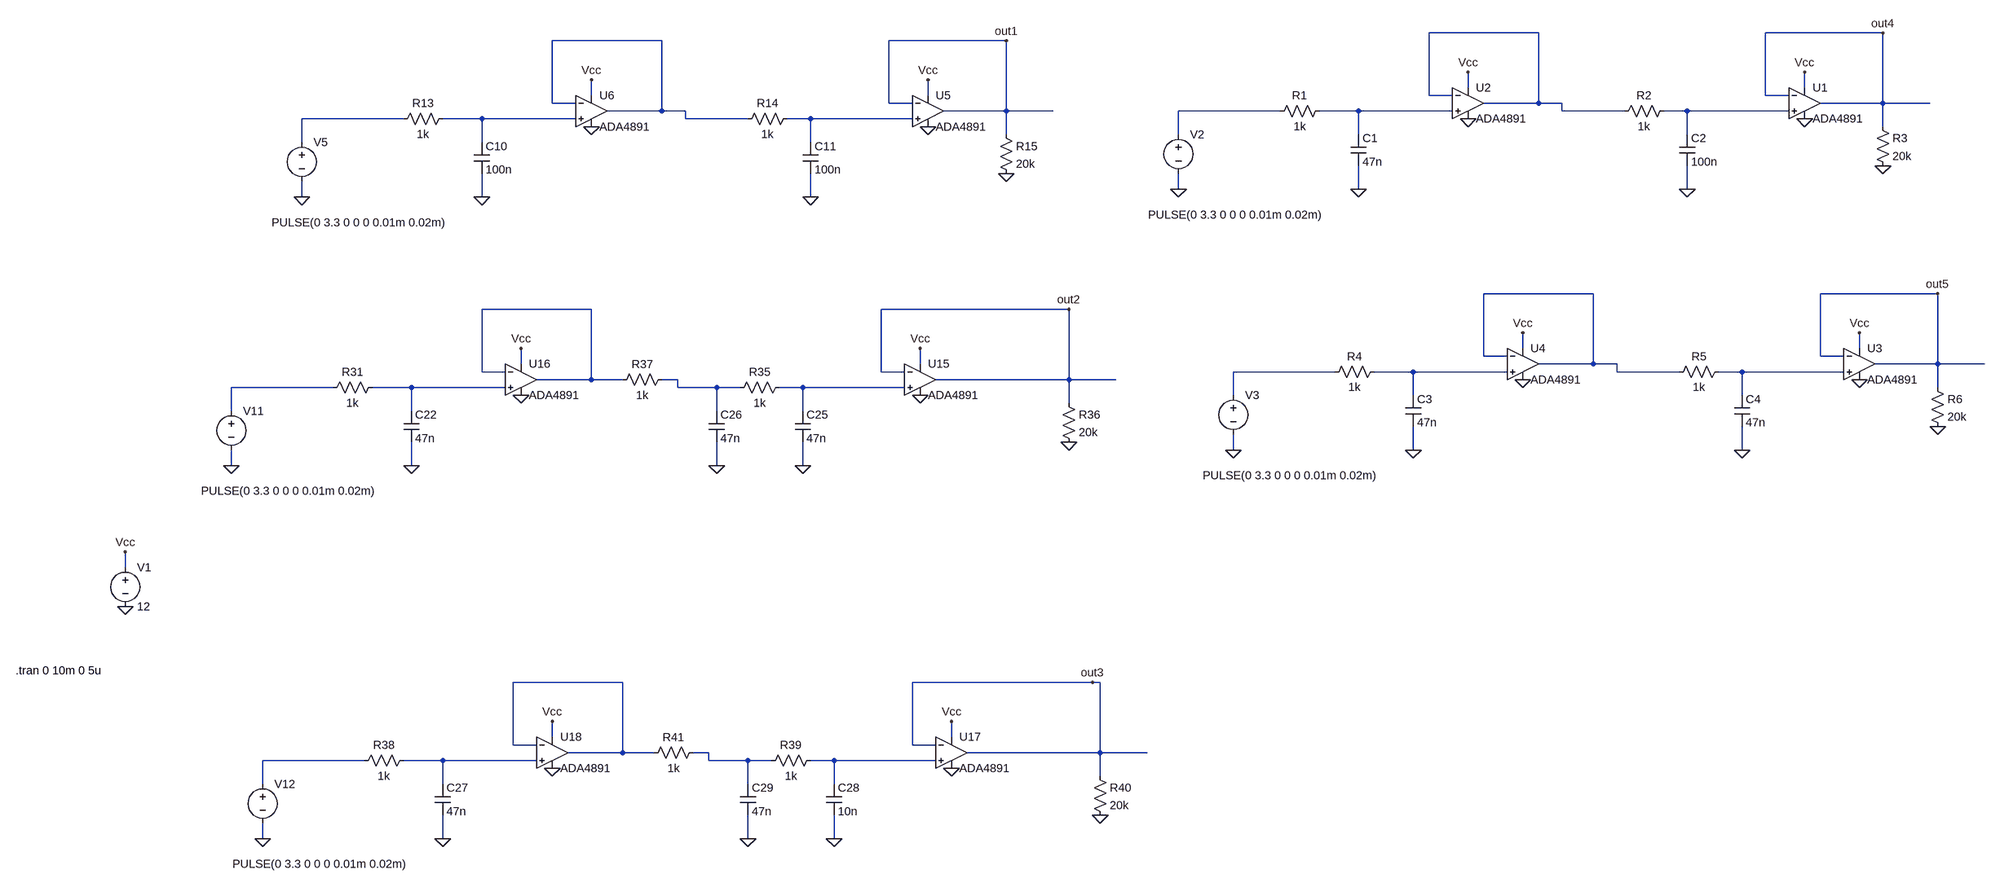
[diagram p0: schematic constant_current.asc]
constant_current.asc, the LTspice schematic file:
Version 4
SHEET 1 3440 3092
WIRE -64 544 -288 544
WIRE 640 544 400 544
WIRE -1856 560 -2080 560
WIRE -1152 560 -1392 560
WIRE -208 656 -208 624
WIRE 480 656 480 624
WIRE -2000 672 -2000 640
WIRE -1312 672 -1312 640
WIRE -288 672 -288 544
WIRE -240 672 -288 672
WIRE 400 672 400 544
WIRE 448 672 400 672
WIRE -2080 688 -2080 560
WIRE -2032 688 -2080 688
WIRE -1392 688 -1392 560
WIRE -1344 688 -1392 688
WIRE -64 688 -64 544
WIRE -64 688 -176 688
WIRE -16 688 -64 688
WIRE 640 688 640 544
WIRE 640 688 512 688
WIRE 736 688 640 688
WIRE -1856 704 -1856 560
WIRE -1856 704 -1968 704
WIRE -1808 704 -1856 704
WIRE -1152 704 -1152 560
WIRE -1152 704 -1280 704
WIRE -1056 704 -1152 704
WIRE -592 704 -800 704
WIRE -432 704 -512 704
WIRE -240 704 -432 704
WIRE -16 704 -16 688
WIRE 112 704 -16 704
WIRE 240 704 192 704
WIRE 448 704 240 704
WIRE -2384 720 -2592 720
WIRE -2224 720 -2304 720
WIRE -2032 720 -2224 720
WIRE -1808 720 -1808 704
WIRE -1680 720 -1808 720
WIRE -1552 720 -1600 720
WIRE -1344 720 -1552 720
WIRE 640 736 640 688
WIRE -1152 752 -1152 704
WIRE -800 752 -800 704
WIRE -432 752 -432 704
WIRE 240 752 240 704
WIRE -2592 768 -2592 720
WIRE -2224 768 -2224 720
WIRE -1552 768 -1552 720
WIRE -800 864 -800 832
WIRE -432 864 -432 816
WIRE 240 864 240 816
WIRE -2592 880 -2592 848
WIRE -2224 880 -2224 832
WIRE -1552 880 -1552 832
WIRE 48 1216 -176 1216
WIRE 752 1216 512 1216
WIRE -2000 1248 -2224 1248
WIRE -1024 1248 -1408 1248
WIRE -96 1328 -96 1296
WIRE 592 1328 592 1296
WIRE -176 1344 -176 1216
WIRE -128 1344 -176 1344
WIRE 512 1344 512 1216
WIRE 560 1344 512 1344
WIRE -2144 1360 -2144 1328
WIRE -1328 1360 -1328 1328
WIRE 48 1360 48 1216
WIRE 48 1360 -64 1360
WIRE 96 1360 48 1360
WIRE 752 1360 752 1216
WIRE 752 1360 624 1360
WIRE 848 1360 752 1360
WIRE -2224 1376 -2224 1248
WIRE -2176 1376 -2224 1376
WIRE -1408 1376 -1408 1248
WIRE -1360 1376 -1408 1376
WIRE -480 1376 -688 1376
WIRE -320 1376 -400 1376
WIRE -128 1376 -320 1376
WIRE 96 1376 96 1360
WIRE 224 1376 96 1376
WIRE 352 1376 304 1376
WIRE 560 1376 352 1376
WIRE -2000 1392 -2000 1248
WIRE -2000 1392 -2112 1392
WIRE -1936 1392 -2000 1392
WIRE -1824 1392 -1856 1392
WIRE -1024 1392 -1024 1248
WIRE -1024 1392 -1296 1392
WIRE -928 1392 -1024 1392
WIRE -2528 1408 -2736 1408
WIRE -2368 1408 -2448 1408
WIRE -2176 1408 -2368 1408
WIRE -1824 1408 -1824 1392
WIRE -1744 1408 -1824 1408
WIRE -1696 1408 -1744 1408
WIRE -1568 1408 -1616 1408
WIRE -1360 1408 -1568 1408
WIRE 752 1408 752 1360
WIRE -688 1424 -688 1376
WIRE -320 1424 -320 1376
WIRE 352 1424 352 1376
WIRE -1024 1440 -1024 1392
WIRE -2736 1456 -2736 1408
WIRE -2368 1456 -2368 1408
WIRE -1744 1456 -1744 1408
WIRE -1568 1456 -1568 1408
WIRE -688 1536 -688 1504
WIRE -320 1536 -320 1488
WIRE 352 1536 352 1488
WIRE -2736 1568 -2736 1536
WIRE -2368 1568 -2368 1520
WIRE -1744 1568 -1744 1520
WIRE -1568 1568 -1568 1520
WIRE -3488 1776 -3488 1744
WIRE -1936 2048 -2160 2048
WIRE -976 2048 -1344 2048
WIRE -960 2048 -976 2048
WIRE -2080 2160 -2080 2128
WIRE -1264 2160 -1264 2128
WIRE -2160 2176 -2160 2048
WIRE -2112 2176 -2160 2176
WIRE -1344 2176 -1344 2048
WIRE -1296 2176 -1344 2176
WIRE -1936 2192 -1936 2048
WIRE -1936 2192 -2048 2192
WIRE -1872 2192 -1936 2192
WIRE -1760 2192 -1792 2192
WIRE -960 2192 -960 2048
WIRE -960 2192 -1232 2192
WIRE -864 2192 -960 2192
WIRE -2464 2208 -2672 2208
WIRE -2304 2208 -2384 2208
WIRE -2112 2208 -2304 2208
WIRE -1760 2208 -1760 2192
WIRE -1680 2208 -1760 2208
WIRE -1632 2208 -1680 2208
WIRE -1504 2208 -1552 2208
WIRE -1296 2208 -1504 2208
WIRE -960 2240 -960 2192
WIRE -2672 2256 -2672 2208
WIRE -2304 2256 -2304 2208
WIRE -1680 2256 -1680 2208
WIRE -1504 2256 -1504 2208
WIRE -2672 2368 -2672 2336
WIRE -2304 2368 -2304 2320
WIRE -1680 2368 -1680 2320
WIRE -1504 2368 -1504 2320
FLAG -3488 1856 0
FLAG -3488 1744 Vcc
FLAG -2592 880 0
FLAG -2224 880 0
FLAG -1552 880 0
FLAG -1312 736 0
FLAG -1312 640 Vcc
FLAG -1152 832 0
FLAG -2000 736 0
FLAG -2000 640 Vcc
FLAG -2736 1568 0
FLAG -2368 1568 0
FLAG -1568 1568 0
FLAG -1328 1424 0
FLAG -1328 1328 Vcc
FLAG -1024 1520 0
FLAG -2144 1424 0
FLAG -2144 1328 Vcc
FLAG -1744 1568 0
FLAG -2672 2368 0
FLAG -2304 2368 0
FLAG -1504 2368 0
FLAG -1264 2224 0
FLAG -1264 2128 Vcc
FLAG -960 2320 0
FLAG -2080 2224 0
FLAG -2080 2128 Vcc
FLAG -1680 2368 0
FLAG -800 864 0
FLAG -432 864 0
FLAG 240 864 0
FLAG 480 720 0
FLAG 480 624 Vcc
FLAG 640 816 0
FLAG -208 720 0
FLAG -208 624 Vcc
FLAG -1152 560 out1
FLAG -1024 1248 out2
FLAG -976 2048 out3
FLAG 640 544 out4
FLAG -688 1536 0
FLAG -320 1536 0
FLAG 352 1536 0
FLAG 592 1392 0
FLAG 592 1296 Vcc
FLAG 752 1488 0
FLAG -96 1392 0
FLAG -96 1296 Vcc
FLAG 752 1216 out5
SYMBOL voltage -3488 1760 R0
WINDOW 123 0 0 Left 0
WINDOW 39 0 0 Left 0
SYMATTR InstName V1
SYMATTR Value 12
SYMBOL voltage -2592 752 R0
WINDOW 123 0 0 Left 0
WINDOW 39 0 0 Left 0
WINDOW 3 -62 180 Left 2
SYMATTR Value PULSE(0 3.3 0 0 0 0.01m 0.02m)
SYMATTR InstName V5
SYMBOL Opamps\\ADA4891 -1312 640 R0
SYMATTR InstName U5
SYMBOL res -2288 704 R90
WINDOW 0 0 56 VBottom 2
WINDOW 3 32 56 VTop 2
SYMATTR InstName R13
SYMATTR Value 1k
SYMBOL res -1584 704 R90
WINDOW 0 0 56 VBottom 2
WINDOW 3 32 56 VTop 2
SYMATTR InstName R14
SYMATTR Value 1k
SYMBOL cap -2240 768 R0
SYMATTR InstName C10
SYMATTR Value 100n
SYMBOL cap -1568 768 R0
SYMATTR InstName C11
SYMATTR Value 100n
SYMBOL res -1168 736 R0
SYMATTR InstName R15
SYMATTR Value 20k
SYMBOL Opamps\\ADA4891 -2000 640 R0
SYMATTR InstName U6
SYMBOL voltage -2736 1440 R0
WINDOW 123 0 0 Left 0
WINDOW 39 0 0 Left 0
WINDOW 3 -62 180 Left 2
SYMATTR Value PULSE(0 3.3 0 0 0 0.01m 0.02m)
SYMATTR InstName V11
SYMBOL Opamps\\ADA4891 -1328 1328 R0
SYMATTR InstName U15
SYMBOL res -2432 1392 R90
WINDOW 0 0 56 VBottom 2
WINDOW 3 32 56 VTop 2
SYMATTR InstName R31
SYMATTR Value 1k
SYMBOL res -1600 1392 R90
WINDOW 0 0 56 VBottom 2
WINDOW 3 32 56 VTop 2
SYMATTR InstName R35
SYMATTR Value 1k
SYMBOL cap -2384 1456 R0
SYMATTR InstName C22
SYMATTR Value 47n
SYMBOL cap -1584 1456 R0
SYMATTR InstName C25
SYMATTR Value 47n
SYMBOL res -1040 1424 R0
SYMATTR InstName R36
SYMATTR Value 20k
SYMBOL Opamps\\ADA4891 -2144 1328 R0
SYMATTR InstName U16
SYMBOL cap -1760 1456 R0
SYMATTR InstName C26
SYMATTR Value 47n
SYMBOL res -1840 1376 R90
WINDOW 0 0 56 VBottom 2
WINDOW 3 32 56 VTop 2
SYMATTR InstName R37
SYMATTR Value 1k
SYMBOL voltage -2672 2240 R0
WINDOW 123 0 0 Left 0
WINDOW 39 0 0 Left 0
WINDOW 3 -62 180 Left 2
SYMATTR Value PULSE(0 3.3 0 0 0 0.01m 0.02m)
SYMATTR InstName V12
SYMBOL Opamps\\ADA4891 -1264 2128 R0
SYMATTR InstName U17
SYMBOL res -2368 2192 R90
WINDOW 0 0 56 VBottom 2
WINDOW 3 32 56 VTop 2
SYMATTR InstName R38
SYMATTR Value 1k
SYMBOL res -1536 2192 R90
WINDOW 0 0 56 VBottom 2
WINDOW 3 32 56 VTop 2
SYMATTR InstName R39
SYMATTR Value 1k
SYMBOL cap -2320 2256 R0
SYMATTR InstName C27
SYMATTR Value 47n
SYMBOL cap -1520 2256 R0
SYMATTR InstName C28
SYMATTR Value 10n
SYMBOL res -976 2224 R0
SYMATTR InstName R40
SYMATTR Value 20k
SYMBOL Opamps\\ADA4891 -2080 2128 R0
SYMATTR InstName U18
SYMBOL cap -1696 2256 R0
SYMATTR InstName C29
SYMATTR Value 47n
SYMBOL res -1776 2176 R90
WINDOW 0 0 56 VBottom 2
WINDOW 3 32 56 VTop 2
SYMATTR InstName R41
SYMATTR Value 1k
SYMBOL voltage -800 736 R0
WINDOW 123 0 0 Left 0
WINDOW 39 0 0 Left 0
WINDOW 3 -62 180 Left 2
SYMATTR Value PULSE(0 3.3 0 0 0 0.01m 0.02m)
SYMATTR InstName V2
SYMBOL Opamps\\ADA4891 480 624 R0
SYMATTR InstName U1
SYMBOL res -496 688 R90
WINDOW 0 0 56 VBottom 2
WINDOW 3 32 56 VTop 2
SYMATTR InstName R1
SYMATTR Value 1k
SYMBOL res 208 688 R90
WINDOW 0 0 56 VBottom 2
WINDOW 3 32 56 VTop 2
SYMATTR InstName R2
SYMATTR Value 1k
SYMBOL cap -448 752 R0
SYMATTR InstName C1
SYMATTR Value 47n
SYMBOL cap 224 752 R0
SYMATTR InstName C2
SYMATTR Value 100n
SYMBOL res 624 720 R0
SYMATTR InstName R3
SYMATTR Value 20k
SYMBOL Opamps\\ADA4891 -208 624 R0
SYMATTR InstName U2
SYMBOL voltage -688 1408 R0
WINDOW 123 0 0 Left 0
WINDOW 39 0 0 Left 0
WINDOW 3 -62 180 Left 2
SYMATTR Value PULSE(0 3.3 0 0 0 0.01m 0.02m)
SYMATTR InstName V3
SYMBOL Opamps\\ADA4891 592 1296 R0
SYMATTR InstName U3
SYMBOL res -384 1360 R90
WINDOW 0 0 56 VBottom 2
WINDOW 3 32 56 VTop 2
SYMATTR InstName R4
SYMATTR Value 1k
SYMBOL res 320 1360 R90
WINDOW 0 0 56 VBottom 2
WINDOW 3 32 56 VTop 2
SYMATTR InstName R5
SYMATTR Value 1k
SYMBOL cap -336 1424 R0
SYMATTR InstName C3
SYMATTR Value 47n
SYMBOL cap 336 1424 R0
SYMATTR InstName C4
SYMATTR Value 47n
SYMBOL res 736 1392 R0
SYMATTR InstName R6
SYMATTR Value 20k
SYMBOL Opamps\\ADA4891 -96 1296 R0
SYMATTR InstName U4
TEXT -3712 2024 Left 2 !.tran 0 10m 0 5u

The netlist it stands for:
* constant_current.asc
V1 Vcc 0 12
V5 N006 0 PULSE(0 3.3 0 0 0 0.01m 0.02m)
XU5 N008 out1 Vcc 0 out1 ADA4891-1  ; pins In+ In- V+ V- OUT
R13 N007 N006 1k
R14 N008 N002 1k
C10 N007 0 100n
C11 N008 0 100n
R15 out1 0 20k
XU6 N007 N002 Vcc 0 N002 ADA4891-1  ; pins In+ In- V+ V- OUT
V11 N015 0 PULSE(0 3.3 0 0 0 0.01m 0.02m)
XU15 N017 out2 Vcc 0 out2 ADA4891-1  ; pins In+ In- V+ V- OUT
R31 N016 N015 1k
R35 N017 N014 1k
C22 N016 0 47n
C25 N017 0 47n
R36 out2 0 20k
XU16 N016 N010 Vcc 0 N010 ADA4891-1  ; pins In+ In- V+ V- OUT
C26 N014 0 47n
R37 N014 N010 1k
V12 N020 0 PULSE(0 3.3 0 0 0 0.01m 0.02m)
XU17 N022 out3 Vcc 0 out3 ADA4891-1  ; pins In+ In- V+ V- OUT
R38 N021 N020 1k
R39 N022 N019 1k
C27 N021 0 47n
C28 N022 0 10n
R40 out3 0 20k
XU18 N021 N018 Vcc 0 N018 ADA4891-1  ; pins In+ In- V+ V- OUT
C29 N019 0 47n
R41 N019 N018 1k
V2 N003 0 PULSE(0 3.3 0 0 0 0.01m 0.02m)
XU1 N005 out4 Vcc 0 out4 ADA4891-1  ; pins In+ In- V+ V- OUT
R1 N004 N003 1k
R2 N005 N001 1k
C1 N004 0 47n
C2 N005 0 100n
R3 out4 0 20k
XU2 N004 N001 Vcc 0 N001 ADA4891-1  ; pins In+ In- V+ V- OUT
V3 N011 0 PULSE(0 3.3 0 0 0 0.01m 0.02m)
XU3 N013 out5 Vcc 0 out5 ADA4891-1  ; pins In+ In- V+ V- OUT
R4 N012 N011 1k
R5 N013 N009 1k
C3 N012 0 47n
C4 N013 0 47n
R6 out5 0 20k
XU4 N012 N009 Vcc 0 N009 ADA4891-1  ; pins In+ In- V+ V- OUT
.tran 0 10m 0 5u
.lib ADA4891-1.lib
.backanno
.end